# EAGLE design Slavenode with NRF (EAGLE 9.5.0)
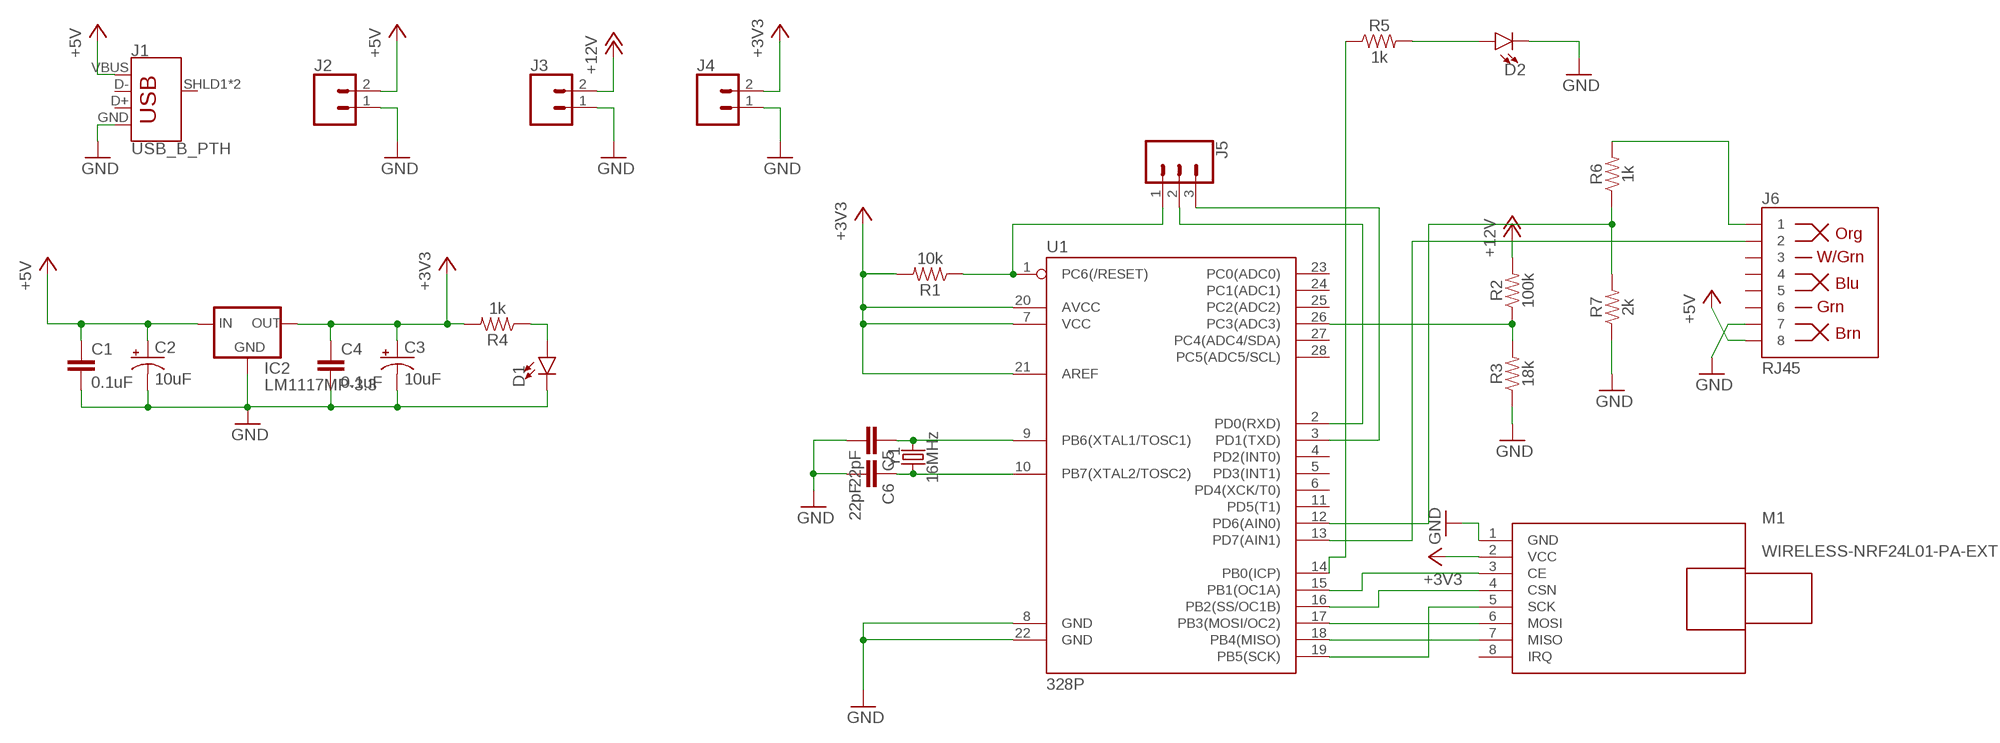
[diagram p0: schematic, sheet 1]

## Parts
C1  0.1uF  0.1UF-KIT-EZ-50V-20%  [CAP-PTH-SMALL-KIT]
C2  10uF  10UF-POLAR-RADIAL-2.5MM-25V-20%  [CPOL-RADIAL-2.5MM-5MM]
C3  10uF  10UF-POLAR-RADIAL-2.5MM-25V-20%  [CPOL-RADIAL-2.5MM-5MM]
C4  0.1uF  0.1UF-KIT-EZ-50V-20%  [CAP-PTH-SMALL-KIT]
C5  22pF  22PF-PTH-2.54MM-200V-5%  [CAP-PTH-2.54]
C6  22pF  22PF-PTH-2.54MM-200V-5%  [CAP-PTH-2.54]
D1  LED-3MM-NO_SILK  [LED_3MM-NS]
D2  LED-3MM-NO_SILK  [LED_3MM-NS]
IC2  LM1117MP-3.3  [SOT223]
J1  USB_B_PTH  [USB-B-PTH]
J2  CONN_02  [1X02]
J3  CONN_02  [1X02]
J4  CONN_02  [1X02]
J5  CONN_03  [1X03]
J6  RJ45  RJ45-8  [RJ45-8]
M1  WIRELESS-NRF24L01-PA-EXT  [WIRELESS-NRF24L01-PA-EXT]
R1  10k  10KOHM-HORIZ-1/4W-1%  [AXIAL-0.3]
R2  100k  100KOHM-HORIZ-1/4W-1%  [AXIAL-0.3]
R3  18k  100KOHM-HORIZ-1/4W-1%  [AXIAL-0.3]
R4  1k  1KOHM-HORIZ-1/4W-1%  [AXIAL-0.3]
R5  1k  1KOHM-HORIZ-1/4W-1%  [AXIAL-0.3]
R6  1k  100KOHM-HORIZ-1/4W-1%  [AXIAL-0.3]
R7  2k  100KOHM-HORIZ-1/4W-1%  [AXIAL-0.3]
U1  328P  ATMEGA328P_PDIP  [DIP28]
Y1  16MHz  CRYSTAL-16MHZPTH-HC49US  [HC49US]

## Nets
+3V3: C3.1(+) C4.1 IC2.2(OUT) IC2.4(OUT) J4.2 M1.2(VCC) R1.P$2 R4.P$2 U1.7(VCC) U1.20(AVCC) U1.21(AREF)
+5V: C1.1 C2.1(+) IC2.3(IN) J1.VBUS J2.2 J6.8
+12V: J3.2 R2.P$2
GND: C1.2 C2.2(-) C3.2(-) C4.2 C5.2 C6.2 D1.K(C) D2.K(C) IC2.1(GND) J1.GND J2.1 J3.1 J4.1 J6.7 M1.1(GND) R3.P$1 R7.P$1 U1.8(GND) U1.22(GND)
N$1: R2.P$1 R3.P$2 U1.26(PC3(ADC3))
N$2: D1.A R4.P$1
N$3: J5.1 R1.P$1 U1.1(PC6(/RESET))
N$4: M1.6(MOSI) U1.17(PB3(MOSI/OC2))
N$5: M1.7(MISO) U1.18(PB4(MISO))
N$6: C5.1 U1.9(PB6(XTAL1/TOSC1)) Y1.2
N$7: C6.1 U1.10(PB7(XTAL2/TOSC2)) Y1.1
N$8: J5.2 U1.2(PD0(RXD))
N$9: J5.3 U1.3(PD1(TXD))
N$10: M1.5(SCK) U1.19(PB5(SCK))
N$12: M1.3(CE) U1.15(PB1(OC1A))
N$14: M1.4(CSN) U1.16(PB2(SS/OC1B))
N$15: J6.2 U1.13(PD7(AIN1))
N$16: R6.P$1 R7.P$2 U1.12(PD6(AIN0))
N$22: R5.P$1 U1.14(PB0(ICP))
N$23: D2.A R5.P$2
N$24: J6.1 R6.P$2
Unconnected: J1.D+ J1.D- J1.SHLD1(SHIELD) J1.SHLD2(SHIELD) J6.3 J6.4 J6.5 J6.6 M1.8(IRQ) U1.4(PD2(INT0)) U1.5(PD3(INT1)) U1.6(PD4(XCK/T0)) U1.11(PD5(T1)) U1.23(PC0(ADC0)) U1.24(PC1(ADC1)) U1.25(PC2(ADC2)) U1.27(PC4(ADC4/SDA)) U1.28(PC5(ADC5/SCL))

## Library data of the parts
C1 C4 = SparkFun-Capacitors:0.1UF: 0.1µF ceramic capacitors A capacitor is a passive two-terminal electrical component used to store electrical energy temporarily in an electric field.; PROD_ID: CAP-08370
C2 C3 = SparkFun-Capacitors:10UF-POLAR: 10.0µF polarized capacitors A capacitor is a passive two-terminal electrical component used to store electrical energy temporarily in an electric field.; PROD_ID: CAP-08440
C5 C6 = SparkFun-Capacitors:22PF: 22pF ceramic capacitors A capacitor is a passive two-terminal electrical component used to store electrical energy temporarily in an electric field.; PROD_ID: CAP-09128
D1 D2 = SparkFun-LED:LED: LED (Generic) Standard schematic elements and footprints for 5mm, 3mm, 1206, and 0603 sized LEDs. Generic LEDs with no color specified.
IC2 = lm1117_10:LM1117?-*: 800mA Low-Dropout Linear Regulator Source: http://www.ti.com/lit/ds/symlink/lm1117-n.pdf; MF: Texas Instruments; MPN: LM1117MP-3.3; OC_FARNELL: 9778195; OC_NEWARK: 28X3416
J1 = SparkFun-Connectors:USB_B: USB Type B Connector SparkFun Products: SparkFun Stepoko <https://www.sparkfun.com/products/13899> PTH; PROD_ID: CONN-08278; SF_ID: PRT-00139
J2-J4 = SparkFun-Connectors:CONN_02: Multi connection point. Often used as Generic Header-pin footprint for 0.1 inch spaced/style header connections On any of the 0.1 inch spaced packages, you can populate with these: Break Away Headers - Straight <https://www.sparkfun.com/products/116> (PRT-00116) Break Away Male Headers - Right Angle <https://www.sparkfun.com/products/553> (PRT-00553) Female Headers <https://www.sparkfun.com/products/115> (PRT-00115) Break Away Headers - Machine Pin <https://www.sparkfun.com/products/117> (PRT-00117) Break Away Female Headers - Swiss Machine Pin <https://www.sparkfun.com/products/743> (PRT-00743) For SCREWTERMINALS and SPRING TERMINALS visit here: Screw Terimnals on SparkFun.com <https://www.sparkfun.com/search/results?term=Screw+Terminals> (5mm/3.5mm/2.54mm spacing) This device is also useful as a general connection point to wire up your design to another part of your project. Our various solder wires solder well into these plated through hole pads. Hook-Up Wire - Assortment (Stranded, 22 AWG) <https://www.sparkfun.com/products/11375> (PRT-11375) Hook-Up Wire - Assortment (Solid Core, 22 AWG) <https://www.sparkfun.com/products/11367> (PRT-11367) View the entire wire category on our website here <https://www.sparkfun.com/categories/141> Special notes: Molex polarized connector foot print use with: PRT-08233 with associated crimp pins and housings. 2.54_SCREWTERM for use with PRT-10571. 3.5mm Screw Terminal footprints for PRT-08084 5mm Screw Terminal footprints for use with PRT-08432
J5 = SparkFun-Connectors:CONN_03: Multi connection point. Often used as Generic Header-pin footprint for 0.1 inch spaced/style header connections On any of the 0.1 inch spaced packages, you can populate with these: Break Away Headers - Straight <https://www.sparkfun.com/products/116> (PRT-00116) Break Away Male Headers - Right Angle <https://www.sparkfun.com/products/553> (PRT-00553) Female Headers <https://www.sparkfun.com/products/115> (PRT-00115) Break Away Headers - Machine Pin <https://www.sparkfun.com/products/117> (PRT-00117) Break Away Female Headers - Swiss Machine Pin <https://www.sparkfun.com/products/743> (PRT-00743) Stackable Header - 3 Pin (Female, 0.1") <https://www.sparkfun.com/products/13875> (PRT-13875) For SCREWTERMINALS and SPRING TERMINALS visit here: Screw Terimnals on SparkFun.com <https://www.sparkfun.com/search/results?term=Screw+Terminals> (5mm/3.5mm/2.54mm spacing) This device is also useful as a general connection point to wire up your design to another part of your project. Our various solder wires solder well into these plated through hole pads. Hook-Up Wire - Assortment (Stranded, 22 AWG) <https://www.sparkfun.com/products/11375> (PRT-11375) Hook-Up Wire - Assortment (Solid Core, 22 AWG) <https://www.sparkfun.com/products/11367> (PRT-11367) View the entire wire category on our website here <https://www.sparkfun.com/categories/141> Special notes: Molex polarized connector foot print use with SKU : PRT-08232 with associated crimp pins and housings.
J6 = SparkFun-Connectors:RJ45-8: RJ45 Jack - 8 pin Simple RJ45, 8-pin connection. Commonly used for Cat5, Cat5e, and Cat6 Ethernet cables. Here is the connector we sell at SparkFun: RJ45 8-Pin Connector <https://www.sparkfun.com/products/643> (PRT-00643) Datasheet <https://cdn.sparkfun.com/datasheets/Prototyping/04908.pdf> It is used on this SparkFun product: SparkFun RJ45 Breakout <https://www.sparkfun.com/products/716> (BOB-00716) Note, you may also be interested in the "MAGJACK" version of this. It is basically a RJ45 connector, but also has some status LEDs built into the connector housing. You can check that out in this library at the device named "MAGJACK.dev" and see these products online: RJ45 Ethernet MagJack-Compatible <https://www.sparkfun.com/products/8534> (PRT-08534) SparkFun RJ45 MagJack Breakout <https://www.sparkfun.com/products/13021> (BOB-13021); PROD_ID: CONN-08506; SF_ID: PRT-00643
M1 = diy-modules:WIRELESS-NRF24L01-PA-EXT: 2.4 GHz Wireless Module based on NRF24L01 chip with preamplifier and external antenna Click here to find device on ebay.com <http://www.ebay.com/sch/nrf24l01+pa+lna+sma>
R1 = SparkFun-Resistors:10KOHM: 10kΩ resistor A resistor is a passive two-terminal electrical component that implements electrical resistance as a circuit element. Resistors act to reduce current flow, and, at the same time, act to lower voltage levels within circuits. - Wikipedia; PROD_ID: RES-12183
R2 = SparkFun-Resistors:100KOHM: 100kΩ resistor A resistor is a passive two-terminal electrical component that implements electrical resistance as a circuit element. Resistors act to reduce current flow, and, at the same time, act to lower voltage levels within circuits. - Wikipedia; PROD_ID: RES-12184
R3 R6 R7 = SparkFun-Resistors:100KOHM: 100kΩ resistor A resistor is a passive two-terminal electrical component that implements electrical resistance as a circuit element. Resistors act to reduce current flow, and, at the same time, act to lower voltage levels within circuits. - Wikipedia; PROD_ID: RES-12184; VALUE: 100k
R4 R5 = SparkFun-Resistors:1KOHM: 1kΩ resistor A resistor is a passive two-terminal electrical component that implements electrical resistance as a circuit element. Resistors act to reduce current flow, and, at the same time, act to lower voltage levels within circuits. - Wikipedia; PROD_ID: RES-12182
U1 = SparkFun-IC-Microcontroller:ATMEGA328P_PDIP: Atmel 328P Through hole ATMEGA328P uC used in the Arduino 32kb flash, 1k EEPROM, 2k SRAM Datasheet <http://www.sparkfun.com/datasheets/Components/SMD/ATMega328.pdf> SparkFun Products Storefront component: AVR 28 Pin 20MHz 32K 6A/D - ATMega328P <https://www.sparkfun.com/products/9061> (COM-09061) SparkFun Simon Says - Through-Hole Soldering Kit <https://www.sparkfun.com/products/10547> (KIT-10547) SparkFun Learn to Solder - Simon Says <https://www.sparkfun.com/products/13708> (KIT-13708) SparkFun BigTime Watch Kit <https://www.sparkfun.com/products/11734> (KIT-11734) SparkFun ClockIt <https://www.sparkfun.com/products/10930> (KIT-10930) SparkFun Serial Enabled LCD Kit <https://www.sparkfun.com/products/10097> (LCD-10097) SparkFun Simon Tilts - Through Hole Soldering Kit <https://www.sparkfun.com/products/12634> (KIT-12634) SparkFun Frequency Counter Kit <https://www.sparkfun.com/products/10140> (KIT-10140) FabFM Radio Kit <https://www.sparkfun.com/products/11043> (KIT-11043) SparkFun Binary Blaster Kit <https://www.sparkfun.com/products/12037> (KIT-12037) SparkFun Metro-Gnome <https://www.sparkfun.com/products/9236> (KIT-09236) ATmega328 with Arduino Optiboot (Uno) <https://www.sparkfun.com/products/10524> (DEV-10524); PROD_ID: IC-09136
Y1 = SparkFun-Clocks:CRYSTAL-16MHZ: 16MHz Crystal Digikey Example <http://www.digikey.com/product-search/en?keywords=535-9122-1-ND> Frequency: 16MHz Frequency Stability: ±50ppm Frequency Tolerance: ±20ppm Load Capacitance: 18pF SparkFun Products: Pro Micro -5V/16MHz <https://www.sparkfun.com/products/12640> SparkFun Serial Enabled LCD Kit <https://www.sparkfun.com/products/10097>; PROD_ID: XTAL-08181; SF_ID: COM-00536

## Board
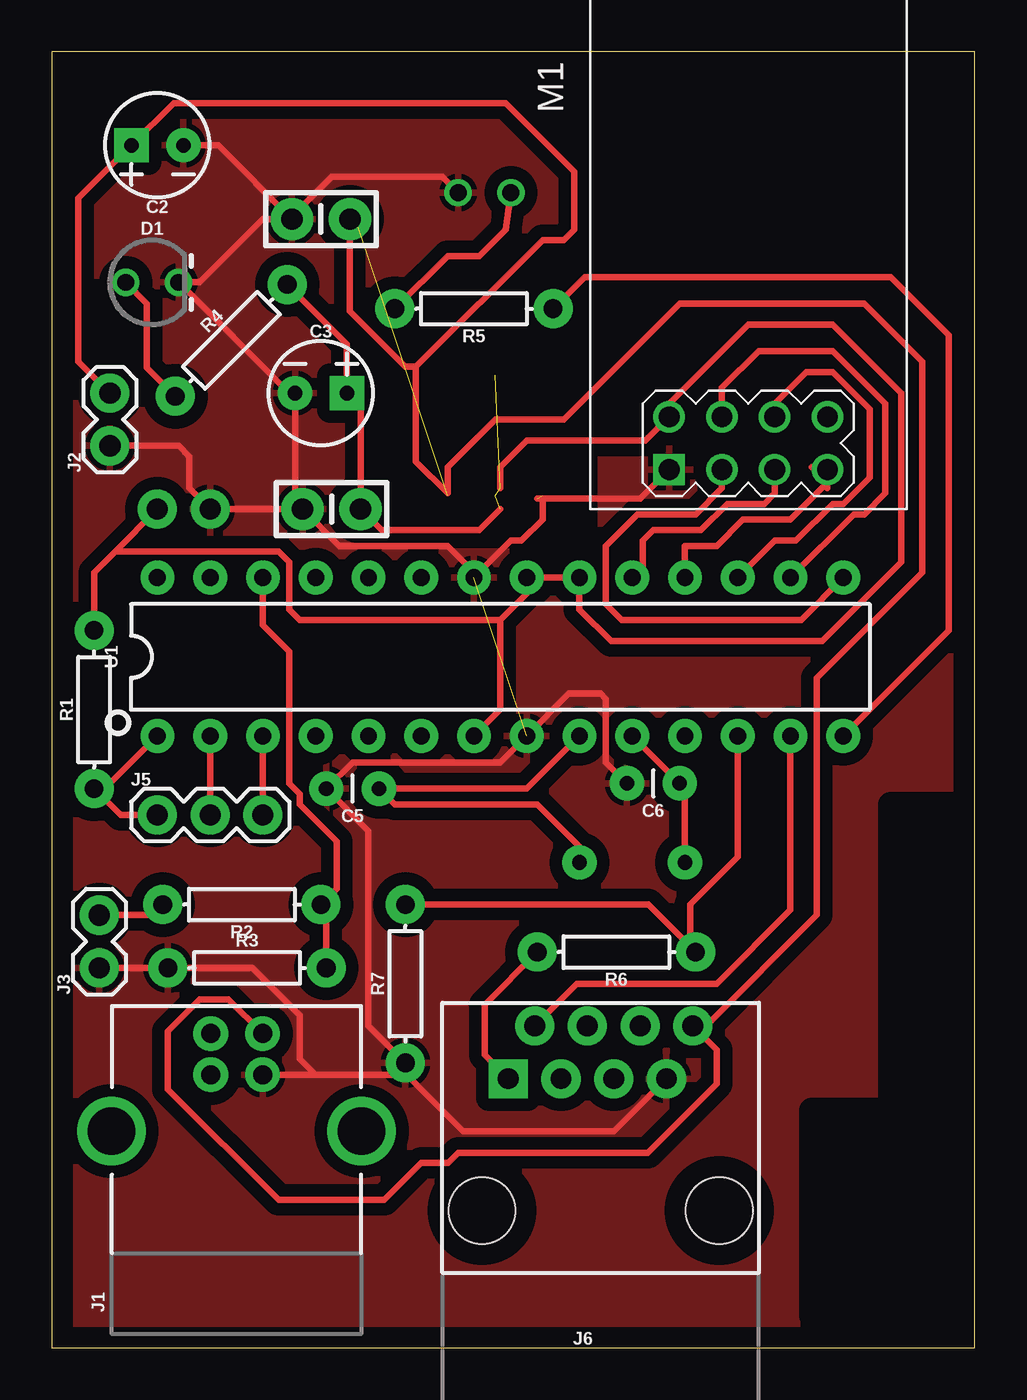
[diagram p1: board, top side]
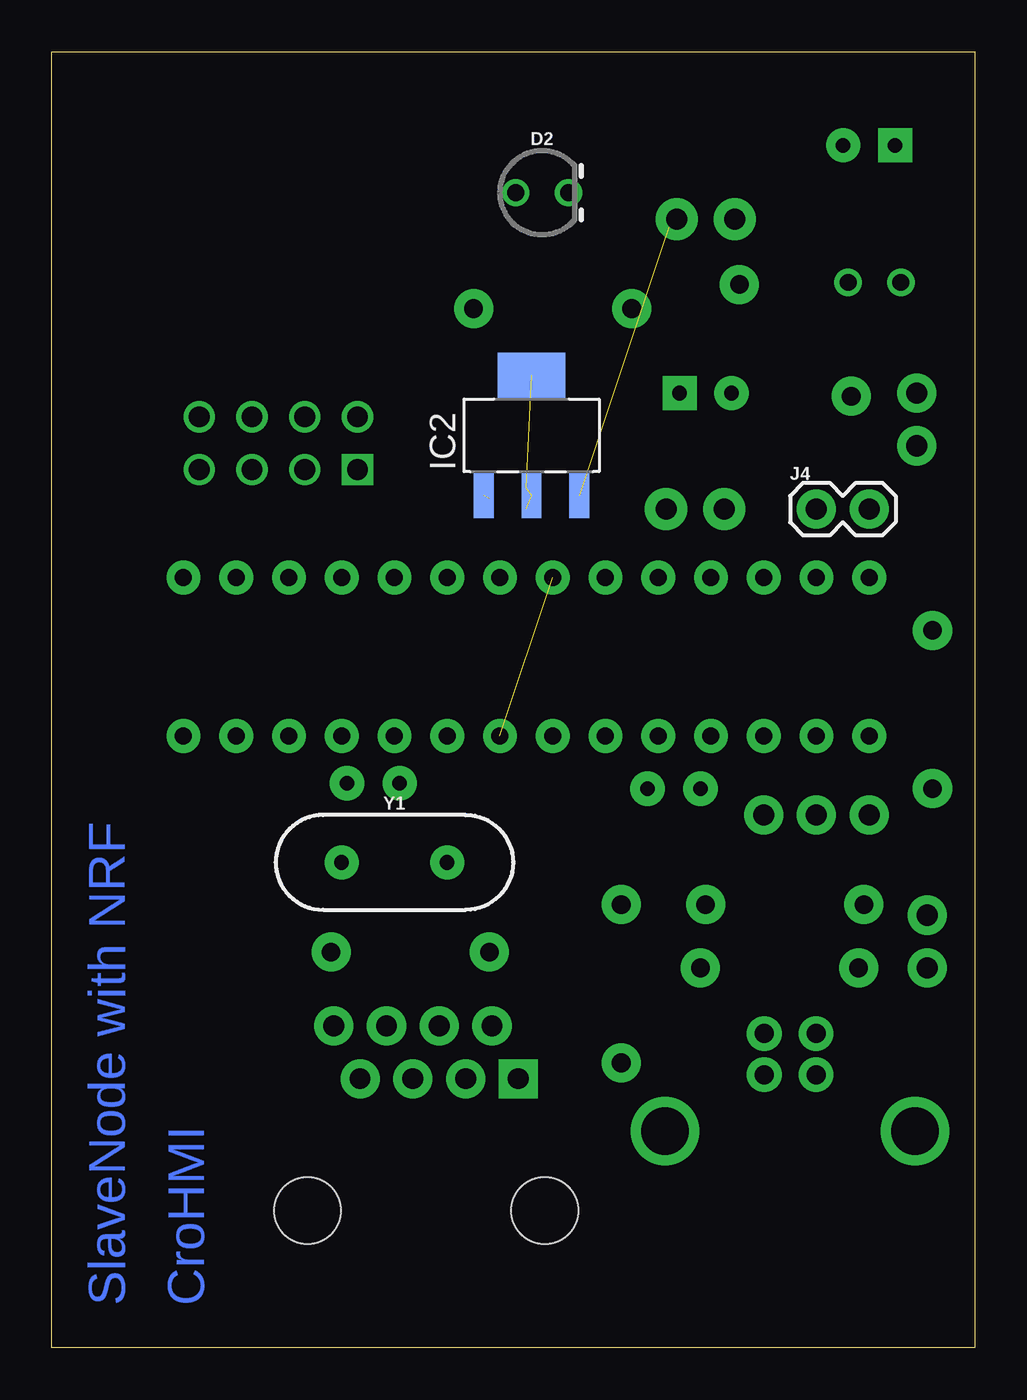
[diagram p2: board, bottom side, seen from below]

Size 44.43 x 62.41 mm. Coordinates in mm from the lower left corner, seen from the top.
Outline: 0,0 44.43,0 44.43,62.41 0,62.41 0,0
Copper layers (1*16): Top 0.035mm / dielectric 1.5mm / Bottom 0.035mm
Design rules "default": minimum track width 6mil, minimum drill 0.35mm, track to track 6mil, track to pad 6mil, pad to pad 6mil, via to via 6mil, smd to smd 6mil, copper to edge 40mil, drill to drill 6mil, minimum pad ring 10mil, minimum via ring 8mil, stop-mask expansion 4mil, vias tented up to drill 0mil, thermal gap 10mil
tRestrict: area 17.5,39.1 to 25.7,48.3; area 36.6,1.5 to 39.6,11.4; area 40.4,1.5 to 43.4,26.2

### Footprints (pad centres in the part's own frame; a part is rotated, then mirrored left to right if it is on the bottom)
CAP-PTH-SMALL-KIT = drill 1.016 pad 2.032: 1 -1.397,0; 2 1.397,0
CPOL-RADIAL-2.5MM-5MM = drill 0.7 pad 1.651 square: 1 1.25,0 | drill 0.7 pad 1.651: 2 -1.25,0
CAP-PTH-2.54 = drill 0.7 pad 1.651: 1 -1.27,0; 2 1.27,0
LED_3MM-NS = drill 0.813: A -1.27,0; K 1.27,0
SOT223 = smd 0.95 x 2.15: 1 -2.3,-2.9; 2 0,-2.9; 3 2.3,-2.9 | smd 3.25 x 2.15: 4 0,2.9
USB-B-PTH = drill 0.914 pad 1.676: D+ 4,1.25; D- 5.981,1.25; GND 4,-1.25; VBUS 5.981,-1.25 | drill 2.286: SHLD1 1.282,-6.02; SHLD2 1.282,6.02
1X02 = drill 1.016 pad 1.88: 1 0,0; 2 2.54,0
1X03 = drill 1.016 pad 1.88: 1 0,0; 2 2.54,0; 3 5.08,0
RJ45-8 = drill 1 pad 1.88 square: 1 -4.445,6.35 | drill 1 pad 1.88: 2 -3.175,8.89; 3 -1.905,6.35; 4 -0.635,8.89; 5 0.635,6.35; 6 1.905,8.89; 7 3.175,6.35; 8 4.445,8.89 | hole 3.2: -5.715,0; 5.715,0
WIRELESS-NRF24L01-PA-EXT = drill 1 square: 1 -18.415,3.81 | drill 1: 2 -15.875,3.81; 3 -18.415,1.27; 4 -15.875,1.27; 5 -18.415,-1.27; 6 -15.875,-1.27; 7 -18.415,-3.81; 8 -15.875,-3.81
AXIAL-0.3 = drill 0.9 pad 1.88: P$1 -3.81,0; P$2 3.81,0
DIP28 = drill 0.813 pad 1.626: 1 -16.51,-3.81; 2 -13.97,-3.81; 3 -11.43,-3.81; 4 -8.89,-3.81; 5 -6.35,-3.81; 6 -3.81,-3.81; 7 -1.27,-3.81; 8 1.27,-3.81; 9 3.81,-3.81; 10 6.35,-3.81; 11 8.89,-3.81; 12 11.43,-3.81; 13 13.97,-3.81; 14 16.51,-3.81; 15 16.51,3.81; 16 13.97,3.81; 17 11.43,3.81; 18 8.89,3.81; 19 6.35,3.81; 20 3.81,3.81; 21 1.27,3.81; 22 -1.27,3.81; 23 -3.81,3.81; 24 -6.35,3.81; 25 -8.89,3.81; 26 -11.43,3.81; 27 -13.97,3.81; 28 -16.51,3.81
HC49US = drill 0.7 pad 1.651: 1 -2.54,0; 2 2.54,0

### Placement (x,y rotation side)
C1  12.95,54.36 180 top
C2  5.08,57.91 180 top
C3  12.95,45.97 0 top
C4  13.46,40.39 180 top
C5  14.48,26.92 180 top
C6  28.96,27.18 180 top
D1  4.83,51.31 0 top
D2  20.83,55.63 0 bottom
IC2  21.34,43.94 0 bottom
J1  8.89,9.14 90 top
J2  2.79,43.43 90 top
J3  2.29,18.29 90 top
J4  7.62,40.39 0 bottom
J5  5.08,25.65 0 top
J6  26.42,6.6 0 top
M1  33.53,60.71 90 top
R1  2.03,30.73 90 top
R2  9.14,21.34 180 top
R3  9.4,18.29 0 top
R4  8.64,48.51 45 top
R5  20.32,50.04 180 top
R6  27.18,19.05 180 top
R7  17.02,17.53 90 top
U1  21.59,33.27 0 top
Y1  27.94,23.37 0 bottom

### Tracks (layer width: path | path; a pad name or v marks a point on that pad's centre or on a via)
+3V3  (3 unrouted)
  Top 0.305: 21.59,41.4 21.59,42.42 22.86,43.69 28.57,43.69 M1.2 29.72,45.47 33.53,49.28 37.59,49.28 40.89,45.97 40.89,37.85 37.08,34.04 26.92,34.04 25.4,35.56 U1.20 U1.21 22.86,36.32 21.59,35.05 | R4.P$2 14.2,48.33 C3.1 14.86,45.32 C4.1 15.88,39.37 20.57,39.37 21.59,40.39 | R1.P$2 2.03,37.34 3.05,38.35 | 3.05,38.35 J4.2 | 3.05,38.35 10.92,38.35 11.43,37.85 11.43,35.56 11.94,35.05 21.59,35.05 | 21.59,35.05 21.59,30.73 U1.7
+5V  (1 unrouted)
  Top 0.305: 10.28,14.99 J1.VBUS 8.5,16.76 7.11,16.76 5.59,15.24 5.59,12.45 10.92,7.11 16,7.11 17.78,8.89 19.07,8.89 19.55,9.37 28.68,9.37 32,12.7 32,14.35 J6.8 31.5,15.49 36.83,20.83 36.83,32.26 41.91,37.34 41.91,47.5 39.12,50.29 30.23,50.29 24.64,44.7 21.34,44.7 19.05,42.42 19.05,41.15 17.53,42.67 17.53,47.24 | J2.2 1.27,47.5 1.27,55.35 C2.1 | C2.1 3.83,58.19 | 14.35,54.99 C1.1 | C1.1 14.73,53.97 | C2.1 5.86,59.94 21.84,59.94 25.15,56.64 25.15,53.85 24.64,53.34 23.62,53.34 17.53,47.24 | 17.53,47.24 17.02,47.24 14.35,49.91 C1.1
+12V
  Top 0.305: R2.P$2 4.83,20.83 J3.2
GND  (2 unrouted)
  Top 0.305: J3.1 R3.P$1 9.65,18.29 11.94,16 11.94,13.91 12.7,13.14 | M1.1 28.32,40.89 23.62,40.89 | 23.62,40.89 23.37,40.89 | C6.2 26.67,28.19 26.67,31.24 26.42,31.5 24.89,31.5 U1.8 21.59,28.19 14.48,28.19 C5.2 15.24,24.89 15.24,15.49 R7.P$1 | C2.2 8,57.91 C1.2 | C1.2 10.16,54.36 7.11,51.31 D1.K 11.43,45.97 C3.2 11.7,40.75 C4.2 | C4.2 J4.1 6.6,41.4 6.6,42.93 6.1,43.43 J2.1 | C4.2 13.84,38.61 19.05,38.61 20.57,37.08 U1.22 22.1,38.86 22.61,38.86 23.62,39.88 23.62,40.89 | C1.2 11.56,54.48 13.46,56.39 18.8,56.39 D2.K | J1.GND 12.7,13.14 | 12.7,13.14 16.45,13.14 R7.P$1 | J6.7 27.05,10.41 19.81,10.41 17.02,13.21 R7.P$1
  pour Top (isolate 0.61): 0,62.48 0,0.25 44.45,0.25 44.45,62.48
N$1
  Top 0.305: R3.P$2 13.21,21.08 R2.P$1 13.72,22.1 13.72,24.38 11.94,26.16 11.94,26.67 11.43,27.18 11.43,33.53 10.16,34.8 U1.26
N$2
  Top 0.305: D1.A 4.57,50.29 4.57,47.19 R4.P$1
N$3
  Top 0.305: J5.1 3.3,25.65 R1.P$1 2.54,26.92 U1.1
N$4
  Top 0.305: M1.6 34.8,45.47 36.32,46.99 37.59,46.99 39.37,45.21 39.37,41.91 38.1,40.64 37.59,40.64 35.81,38.86 34.8,38.86 U1.17
N$5
  Top 0.305: 36.58,42.42 37.21,42.42 M1.7 | 37.34,41.4 M1.7 | U1.18 30.48,38.61 32,38.61 33.27,39.88 35.56,39.88 37.34,41.66 M1.7
N$6
  Top 0.305: U1.9 22.86,26.92 C5.1 16.51,26.16 23.37,26.16 25.4,24.13 Y1.2
N$7
  Top 0.305: U1.10 30.48,26.92 | 30.48,26.92 30.48,26.67 Y1.1 | 30.48,26.92 30.48,27.18 C6.1
N$8
  Top 0.305: J5.2 U1.2
N$9
  Top 0.305: J5.3 U1.3
N$10
  Top 0.305: M1.5 34.8,42.16 34.8,41.91 34.8,41.15 34.29,40.64 32.51,40.64 31.24,39.37 28.96,39.37 28.45,38.86 28.45,37.59 U1.19
N$12
  Top 0.305: U1.15 36.07,35.05 27.43,35.05 26.67,35.81 26.67,38.61 28.19,40.13 29.46,40.13 29.72,40.13 30.99,40.13 32.26,41.4 M1.3 31.88,42.29
N$14
  Top 0.305: U1.16 38.61,40.13 39.12,40.13 40.13,41.15 40.13,45.47 37.59,48.01 34.04,48.01 32.26,46.23 M1.4
N$15
  Top 0.305: J6.2 25.27,17.53 32,17.53 35.56,21.08 U1.13
N$16
  Top 0.305: U1.12 33.02,23.62 30.73,21.34 30.73,19.3 R6.P$1 28.7,21.34 R7.P$2
N$22
  Top 0.305: R5.P$1 25.65,51.56 40.39,51.56 43.18,48.77 43.18,34.54 U1.14
N$23
  Top 0.305: R5.P$2 19.05,52.58 20.57,52.58 21.84,53.85 D2.A
N$24
  Top 0.305: J6.1 20.83,14.1 20.83,16.51 R6.P$2

### Text on the board
Bottom: CroHMI | SlaveNode with NRF